# Altium schematic sheet BMU_V50_Connector.SchDoc
size C
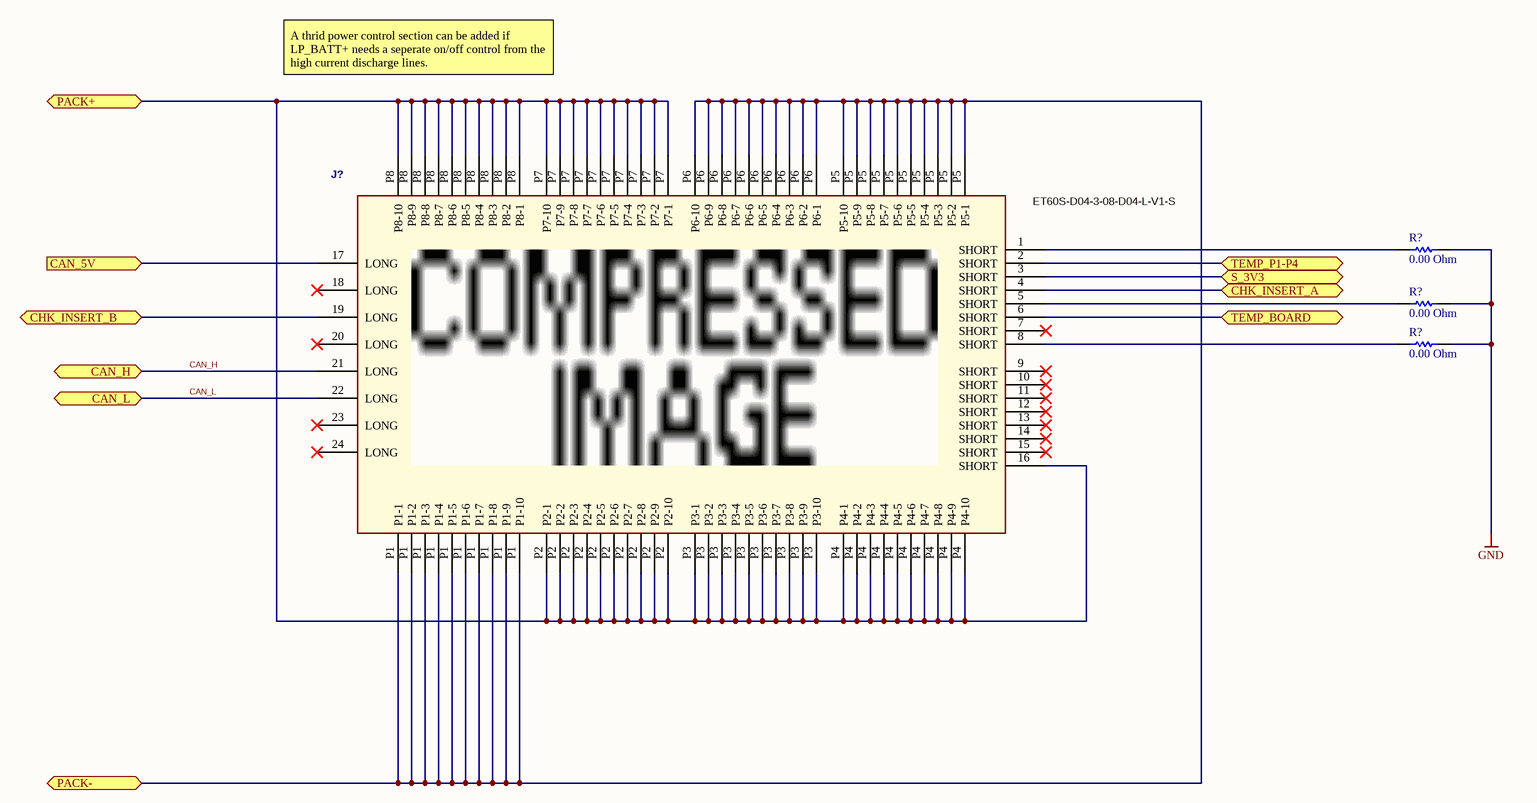
[diagram p0: BMU_V50_Connector.SchDoc]

## Parts
(Parts that share a designator on the sheet are numbered #1, #2 ... from top to bottom, then left to right.)
J?  ET60S-D04-3-08-D04-L-V1-S  [ET60S-D04-3-08-D04-L-V1-S]
R?#1  value 0.00 Ohm  [RESC0402(1005)_L]  (hidden comment: Jumper 0402(1005))
R?#2  value 0.00 Ohm  [RESC0402(1005)_L]  (hidden comment: Jumper 0402(1005))
R?#3  value 0.00 Ohm  [RESC0402(1005)_L]  (hidden comment: Jumper 0402(1005))

## Ports
CAN_5V (in), CAN_H (bidir), CAN_L (bidir), CHK_INSERT_A (bidir), CHK_INSERT_B (bidir), PACK+ (bidir), PACK- (bidir), S_3V3 (bidir), TEMP_BOARD (bidir), TEMP_P1-P4 (bidir)

## Nets
GND: R?#1.1 R?#2.1 R?#3.2
CAN_5V: J?.17(LONG) ; port CAN_5V
CAN_H: J?.21(LONG) ; port CAN_H
CAN_L: J?.22(LONG) ; port CAN_L
CHK_INSERT_A: J?.4(SHORT) ; port CHK_INSERT_A
CHK_INSERT_B: J?.19(LONG) ; port CHK_INSERT_B
PACK+: J?.16(SHORT) J?.P2(P2-1) J?.P3(P3-1) J?.P4(P4-1) J?.P7(P7-1) J?.P8(P8-1) ; port PACK+
PACK-: J?.P1(P1-1) J?.P5(P5-1) J?.P6(P6-1) ; port PACK-
S_3V3: J?.3(SHORT) ; port S_3V3
TEMP_BOARD: J?.6(SHORT) ; port TEMP_BOARD
TEMP_P1-P4: J?.2(SHORT) ; port TEMP_P1-P4
NetJ?_1: J?.1(SHORT) R?#1.2
NetJ?_5: J?.5(SHORT) R?#2.2
NetJ?_8: J?.8(SHORT) R?#3.1

Not connected (* = marked no-connect by the designer): J? 7(SHORT)* 9(SHORT)* 10(SHORT)* 11(SHORT)* 12(SHORT)* 13(SHORT)* 14(SHORT)* 15(SHORT)* 18(LONG)* 20(LONG)* 23(LONG)* 24(LONG)*

## Notes on the sheet
- A thrid power control section can be added if LP_BATT+ needs a seperate on/off control from the high current discharge lines.
- Title
- MATTERNET
- PROPRIETRY & CONFIDENTIAL
  THE INFORMATION CONTAINS IN THIS DRAWING
  IS THE SOLE PROPERTY OF  MATTERNET Inc.
  ANY REPRODUCTION IN PART OR AS WHOLE
  WITHOUT A WRITTEN PERMISSION OF
  MATTERNET Inc. IS PROHIBITED
- Size:
- Date:
- File:
- C
- Number:
- Time:
- Revision:
- Sheet
- of
- 161 E. Evelyn Ave.
- Mountain View,
- CA 94041 USA

## Library data of the parts
J? = ET60S-D04-3-08-D04-L-V1-S: EXtreme Ten60 Power Connector; custinv: Samtec; custprt: ET60S-D04-3-08-D04-L-V1-S; Supplier 1: Mouser; Supplier Part Number 1: 200-60SD04308D04LV1S; Manufacturer: Samtec; Manufacturer Part Number: ET60S-D04-3-08-D04-L-V1-S; Stock 1: 0; Pricing 1: 1=7.94, 10=7.35, 50=6.59, 100=6.15, 1000=4.96, 10000=4.96 (USD); Supplier 2: Farnell; Supplier Part Number 2: 2731048; Stock 2: 0
R?#1-R?#3 = CMP-1011-00001-1: Jumper 0402 (1005 Metric); Tolerance: None; Case-Metric: 1005; Case-EIA: 0402; Power: None; Technology: SMT